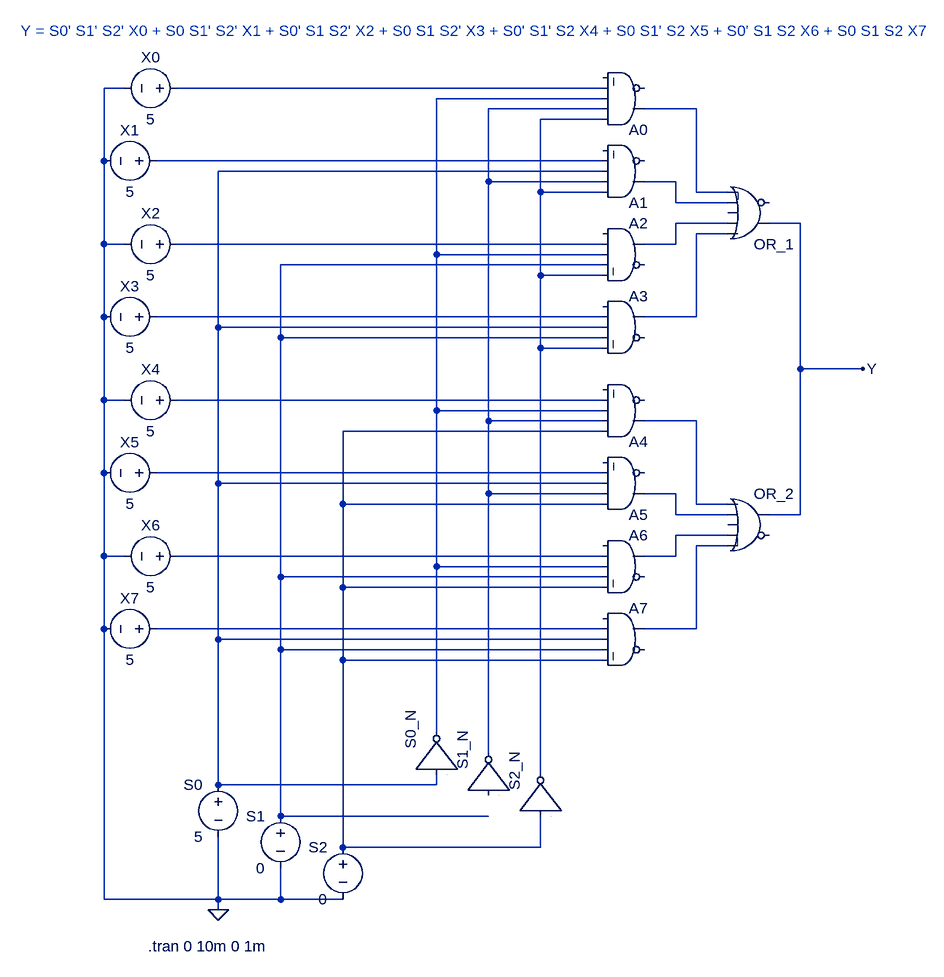
[diagram p0: schematic ADMUX.asc]
ADMUX.asc, the LTspice schematic file:
Version 4
SHEET 1 1260 1384
WIRE -512 48 -544 48
WIRE 224 48 -432 48
WIRE 224 64 -32 64
WIRE 224 80 48 80
WIRE 368 80 288 80
WIRE 224 96 128 96
WIRE -544 160 -544 48
WIRE 224 160 -464 160
WIRE 224 176 -368 176
WIRE 48 192 48 80
WIRE 224 192 48 192
WIRE 336 192 288 192
WIRE 128 208 128 96
WIRE 224 208 128 208
WIRE 368 208 368 80
WIRE 416 208 368 208
WIRE 336 224 336 192
WIRE 416 224 336 224
WIRE 416 256 336 256
WIRE 528 256 480 256
WIRE 416 272 368 272
WIRE -544 288 -544 160
WIRE -512 288 -544 288
WIRE 224 288 -432 288
WIRE 336 288 336 256
WIRE 336 288 288 288
WIRE -32 304 -32 64
WIRE 224 304 -32 304
WIRE 224 320 -272 320
WIRE 128 336 128 208
WIRE 224 336 128 336
WIRE -544 400 -544 288
WIRE 224 400 -464 400
WIRE 368 400 368 272
WIRE 368 400 288 400
WIRE -368 416 -368 176
WIRE 224 416 -368 416
WIRE -272 432 -272 320
WIRE 224 432 -272 432
WIRE 128 448 128 336
WIRE 224 448 128 448
WIRE 528 480 528 256
WIRE 624 480 528 480
WIRE -544 528 -544 400
WIRE -512 528 -544 528
WIRE 224 528 -432 528
WIRE -32 544 -32 304
WIRE 224 544 -32 544
WIRE 48 560 48 192
WIRE 224 560 48 560
WIRE 368 560 288 560
WIRE 224 576 -176 576
WIRE -544 640 -544 528
WIRE 224 640 -464 640
WIRE -368 656 -368 416
WIRE 224 656 -368 656
WIRE 48 672 48 560
WIRE 224 672 48 672
WIRE 336 672 288 672
WIRE -176 688 -176 576
WIRE 224 688 -176 688
WIRE 368 688 368 560
WIRE 416 688 368 688
WIRE 336 704 336 672
WIRE 416 704 336 704
WIRE 528 704 528 480
WIRE 528 704 480 704
WIRE 416 736 336 736
WIRE 416 752 368 752
WIRE -544 768 -544 640
WIRE -512 768 -544 768
WIRE 224 768 -432 768
WIRE 336 768 336 736
WIRE 336 768 288 768
WIRE -32 784 -32 544
WIRE 224 784 -32 784
WIRE -272 800 -272 432
WIRE 224 800 -272 800
WIRE -176 816 -176 688
WIRE 224 816 -176 816
WIRE -544 880 -544 768
WIRE 224 880 -464 880
WIRE 368 880 368 752
WIRE 368 880 288 880
WIRE -368 896 -368 656
WIRE 224 896 -368 896
WIRE -272 912 -272 800
WIRE 224 912 -272 912
WIRE -176 928 -176 816
WIRE 224 928 -176 928
WIRE -32 1040 -32 784
WIRE 48 1072 48 672
WIRE 128 1104 128 448
WIRE -368 1120 -368 896
WIRE -32 1120 -32 1104
WIRE -32 1120 -368 1120
WIRE -272 1168 -272 912
WIRE 48 1168 -272 1168
WIRE -176 1216 -176 928
WIRE 128 1216 128 1168
WIRE 128 1216 -176 1216
WIRE -544 1296 -544 880
WIRE -368 1296 -368 1200
WIRE -368 1296 -544 1296
WIRE -272 1296 -272 1248
WIRE -272 1296 -368 1296
WIRE -176 1296 -272 1296
WIRE -368 1312 -368 1296
FLAG 624 480 Y
FLAG -368 1312 0
SYMBOL Digital\\and 256 240 M180
SYMATTR InstName A1
SYMATTR SpiceLine vhigh=5
SYMBOL Digital\\and 256 128 M180
SYMATTR InstName A0
SYMATTR SpiceLine vhigh=5
SYMBOL Digital\\and 256 240 R0
SYMATTR InstName A2
SYMATTR SpiceLine vhigh=5
SYMBOL Digital\\and 256 352 R0
SYMATTR InstName A3
SYMATTR SpiceLine vhigh=5
SYMBOL Digital\\and 256 608 M180
SYMATTR InstName A4
SYMATTR SpiceLine vhigh=5
SYMBOL Digital\\and 256 720 M180
SYMATTR InstName A5
SYMATTR SpiceLine vhigh=5
SYMBOL Digital\\and 256 720 R0
SYMATTR InstName A6
SYMATTR SpiceLine vhigh=5
SYMBOL Digital\\and 256 832 R0
SYMATTR InstName A7
SYMATTR SpiceLine vhigh=5
SYMBOL Digital\\or 448 656 R0
SYMATTR InstName OR_2
SYMATTR SpiceLine vhigh=5
SYMBOL Digital\\or 448 304 M180
SYMATTR InstName OR_1
SYMATTR SpiceLine vhigh=5
SYMBOL Digital\\inv -96 1104 R270
SYMATTR InstName S0_N
SYMATTR SpiceLine vhigh=5
SYMBOL Digital\\inv -16 1136 R270
SYMATTR InstName S1_N
SYMATTR SpiceLine vhigh=5
SYMBOL Digital\\inv 64 1168 R270
SYMATTR InstName S2_N
SYMATTR SpiceLine vhigh=5
SYMBOL voltage -368 1104 M0
SYMATTR InstName S0
SYMATTR Value 5
SYMBOL voltage -272 1152 M0
SYMATTR InstName S1
SYMATTR Value 0
SYMBOL voltage -176 1200 M0
SYMATTR InstName S2
SYMATTR Value 0
SYMBOL voltage -416 48 R90
WINDOW 0 -32 56 VBottom 2
WINDOW 3 32 56 VTop 2
SYMATTR InstName X0
SYMATTR Value 5
SYMBOL voltage -448 160 R90
WINDOW 0 -32 56 VBottom 2
WINDOW 3 32 56 VTop 2
SYMATTR InstName X1
SYMATTR Value 5
SYMBOL voltage -416 288 R90
WINDOW 0 -32 56 VBottom 2
WINDOW 3 32 56 VTop 2
SYMATTR InstName X2
SYMATTR Value 5
SYMBOL voltage -448 400 R90
WINDOW 0 -32 56 VBottom 2
WINDOW 3 32 56 VTop 2
SYMATTR InstName X3
SYMATTR Value 5
SYMBOL voltage -416 528 R90
WINDOW 0 -32 56 VBottom 2
WINDOW 3 32 56 VTop 2
SYMATTR InstName X4
SYMATTR Value 5
SYMBOL voltage -448 640 R90
WINDOW 0 -32 56 VBottom 2
WINDOW 3 32 56 VTop 2
SYMATTR InstName X5
SYMATTR Value 5
SYMBOL voltage -416 768 R90
WINDOW 0 -32 56 VBottom 2
WINDOW 3 32 56 VTop 2
SYMATTR InstName X6
SYMATTR Value 5
SYMBOL voltage -448 880 R90
WINDOW 0 -32 56 VBottom 2
WINDOW 3 32 56 VTop 2
SYMATTR InstName X7
SYMATTR Value 5
TEXT -476 1368 Left 2 !.tran 0 10m 0 1m
TEXT -672 -40 Left 2 ;Y = S0' S1' S2' X0 + S0 S1' S2' X1 + S0' S1 S2' X2 + S0 S1 S2' X3 + S0' S1' S2 X4 + S0 S1' S2 X5 + S0' S1 S2 X6 + S0 S1 S2 X7

The netlist it stands for:
* ADMUX.asc
A1 N005 N003 N007 N006 0 0 N008 0 AND vhigh=5
A0 N005 N003 N002 N001 0 0 N004 0 AND vhigh=5
A2 0 N011 N002 N012 N005 0 N009 0 AND vhigh=5
A3 0 N013 N007 N012 N005 0 N010 0 AND vhigh=5
A4 N016 N003 N002 N014 0 0 N015 0 AND vhigh=5
A5 N016 N003 N007 N017 0 0 N018 0 AND vhigh=5
A6 0 N021 N002 N012 N016 0 N019 0 AND vhigh=5
A7 0 N022 N007 N012 N016 0 N020 0 AND vhigh=5
A§OR_2 N015 N018 0 N019 N020 0 Y 0 OR vhigh=5
A§OR_1 N010 N009 0 N008 N004 0 Y 0 OR vhigh=5
A§S0_N N007 0 0 0 0 N002 0 0 BUF vhigh=5
A§S1_N 0 0 0 0 0 N003 0 0 BUF vhigh=5
A§S2_N N016 0 0 0 0 N005 0 0 BUF vhigh=5
V§S0 N007 0 5
V§S1 N012 0 0
V§S2 N016 0 0
V§X0 N001 0 5
V§X1 N006 0 5
V§X2 N011 0 5
V§X3 N013 0 5
V§X4 N014 0 5
V§X5 N017 0 5
V§X6 N021 0 5
V§X7 N022 0 5
.tran 0 10m 0 1m
* Y = S0' S1' S2' X0 + S0 S1' S2' X1 + S0' S1 S2' X2 + S0 S1 S2' X3 + S0' S1' S2 X4 + S0 S1' S2 X5 + S0' S1 S2 X6 + S0 S1 S2 X7
.backanno
.end